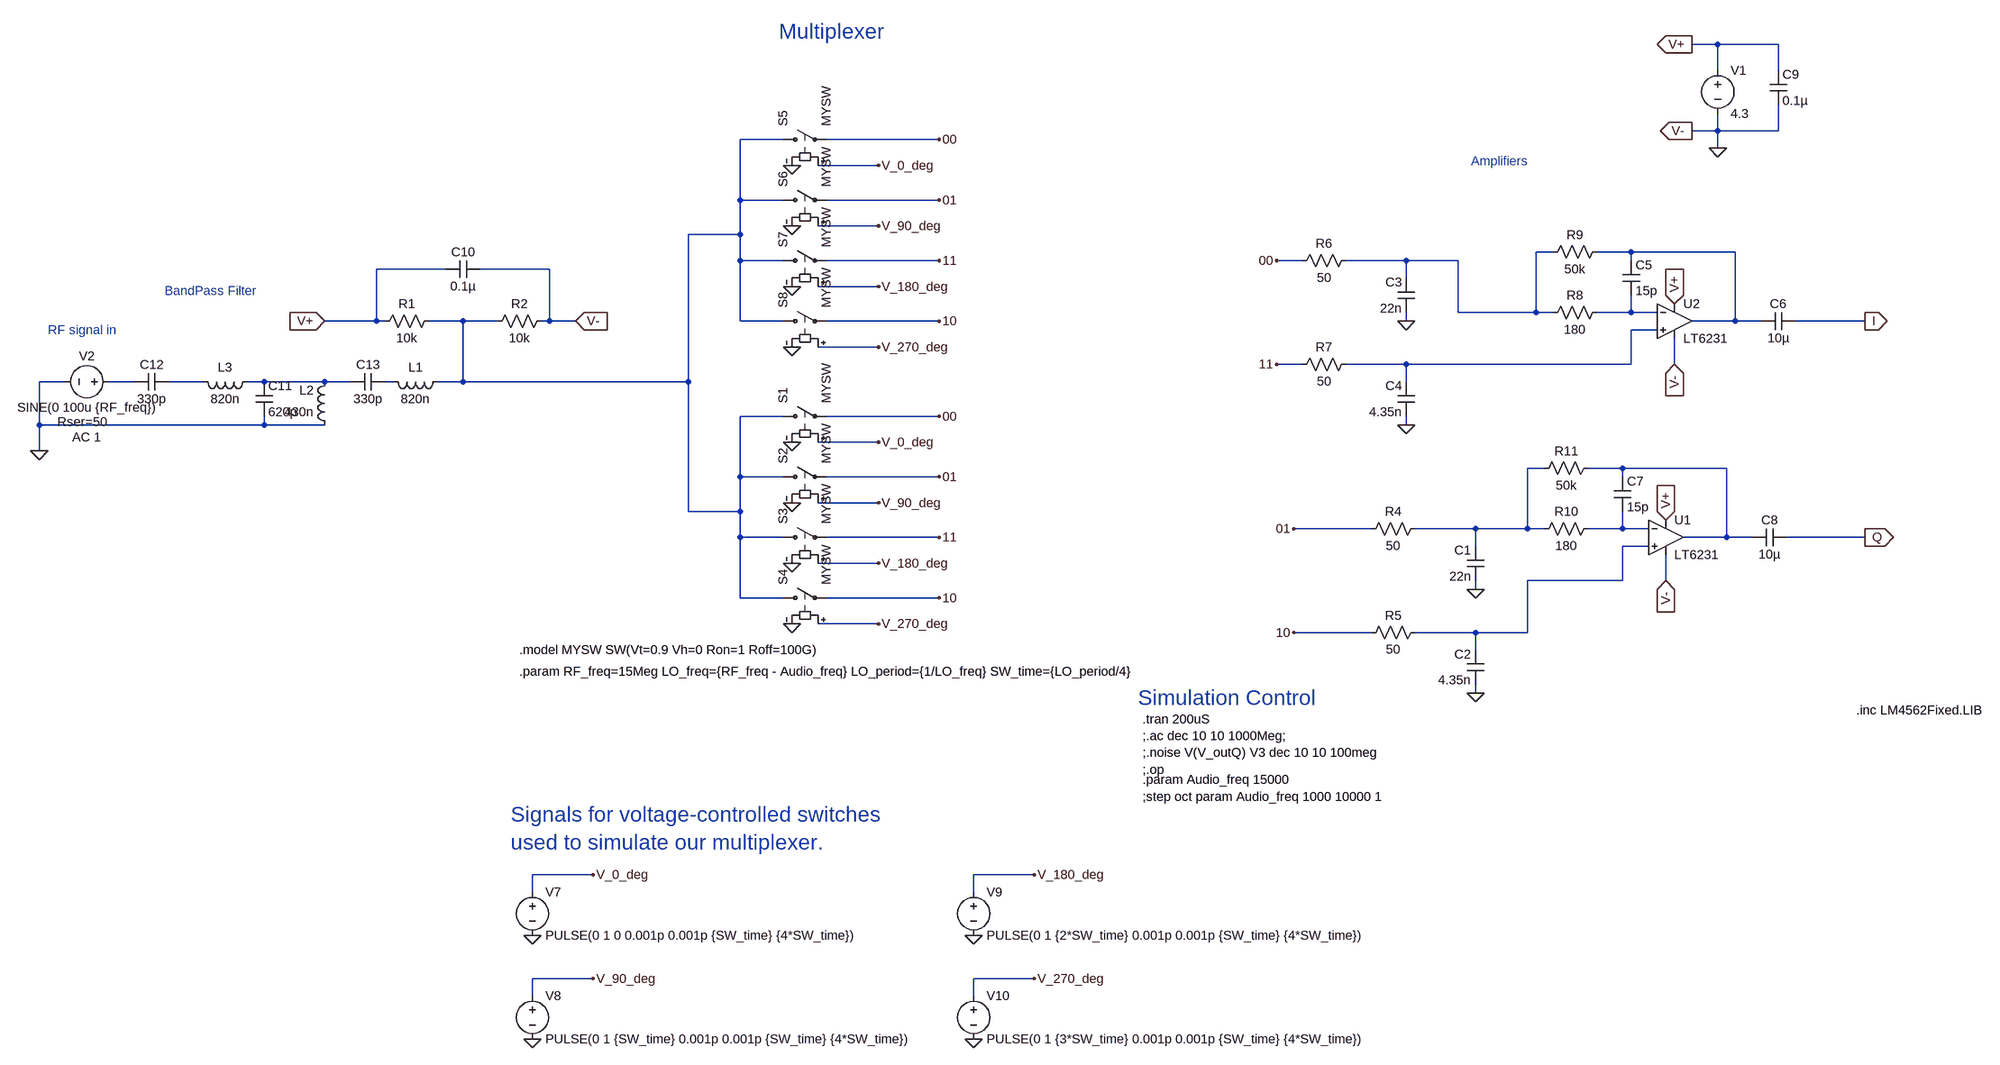
[diagram p0: schematic SImulation tests.asc]
SImulation tests.asc, the LTspice schematic file:
Version 4
SHEET 1 1280 680
WIRE -336 -1360 -384 -1360
WIRE -224 -1360 -336 -1360
WIRE -336 -1312 -336 -1360
WIRE -224 -1312 -224 -1360
WIRE -336 -1200 -336 -1232
WIRE -336 -1200 -384 -1200
WIRE -224 -1200 -224 -1248
WIRE -224 -1200 -336 -1200
WIRE -2064 -1184 -2144 -1184
WIRE -1776 -1184 -1984 -1184
WIRE -336 -1168 -336 -1200
WIRE -1888 -1136 -2000 -1136
WIRE -2144 -1072 -2144 -1184
WIRE -2064 -1072 -2144 -1072
WIRE -1776 -1072 -1984 -1072
WIRE -1888 -1024 -2000 -1024
WIRE -2144 -1008 -2144 -1072
WIRE -2144 -1008 -2240 -1008
WIRE -640 -976 -672 -976
WIRE -496 -976 -560 -976
WIRE -304 -976 -496 -976
WIRE -2144 -960 -2144 -1008
WIRE -2064 -960 -2144 -960
WIRE -1776 -960 -1984 -960
WIRE -1104 -960 -1152 -960
WIRE -912 -960 -1024 -960
WIRE -816 -960 -912 -960
WIRE -496 -960 -496 -976
WIRE -2688 -944 -2816 -944
WIRE -2496 -944 -2624 -944
WIRE -912 -928 -912 -960
WIRE -1888 -912 -2000 -912
WIRE -816 -864 -816 -960
WIRE -672 -864 -672 -976
WIRE -672 -864 -816 -864
WIRE -640 -864 -672 -864
WIRE -496 -864 -496 -896
WIRE -496 -864 -560 -864
WIRE -448 -864 -496 -864
WIRE -2816 -848 -2816 -944
WIRE -2816 -848 -2912 -848
WIRE -2800 -848 -2816 -848
WIRE -2656 -848 -2720 -848
WIRE -2592 -848 -2656 -848
WIRE -2496 -848 -2496 -944
WIRE -2496 -848 -2512 -848
WIRE -2448 -848 -2496 -848
WIRE -2144 -848 -2144 -960
WIRE -2064 -848 -2144 -848
WIRE -1776 -848 -1984 -848
WIRE -912 -848 -912 -864
WIRE -304 -848 -304 -976
WIRE -304 -848 -384 -848
WIRE -256 -848 -304 -848
WIRE -64 -848 -192 -848
WIRE -448 -832 -496 -832
WIRE -1888 -800 -2000 -800
WIRE -1104 -768 -1152 -768
WIRE -912 -768 -1024 -768
WIRE -496 -768 -496 -832
WIRE -496 -768 -912 -768
WIRE -416 -768 -416 -816
WIRE -3392 -736 -3440 -736
WIRE -3264 -736 -3312 -736
WIRE -3136 -736 -3200 -736
WIRE -3024 -736 -3056 -736
WIRE -2912 -736 -3024 -736
WIRE -2864 -736 -2912 -736
WIRE -2784 -736 -2800 -736
WIRE -2656 -736 -2656 -848
WIRE -2656 -736 -2704 -736
WIRE -2240 -736 -2240 -1008
WIRE -2240 -736 -2656 -736
WIRE -912 -736 -912 -768
WIRE -2064 -672 -2144 -672
WIRE -1776 -672 -1984 -672
WIRE -3440 -656 -3440 -736
WIRE -3024 -656 -3024 -672
WIRE -3024 -656 -3440 -656
WIRE -2912 -656 -3024 -656
WIRE -912 -656 -912 -672
WIRE -1888 -624 -2000 -624
WIRE -3440 -608 -3440 -656
WIRE -656 -576 -688 -576
WIRE -512 -576 -576 -576
WIRE -320 -576 -512 -576
WIRE -2144 -560 -2144 -672
WIRE -2064 -560 -2144 -560
WIRE -1776 -560 -1984 -560
WIRE -512 -560 -512 -576
WIRE -1888 -512 -2000 -512
WIRE -2240 -496 -2240 -736
WIRE -2144 -496 -2144 -560
WIRE -2144 -496 -2240 -496
WIRE -976 -464 -1120 -464
WIRE -784 -464 -896 -464
WIRE -688 -464 -688 -576
WIRE -688 -464 -784 -464
WIRE -656 -464 -688 -464
WIRE -512 -464 -512 -496
WIRE -512 -464 -576 -464
WIRE -464 -464 -512 -464
WIRE -2144 -448 -2144 -496
WIRE -2064 -448 -2144 -448
WIRE -1776 -448 -1984 -448
WIRE -320 -448 -320 -576
WIRE -320 -448 -400 -448
WIRE -272 -448 -320 -448
WIRE -64 -448 -208 -448
WIRE -784 -432 -784 -464
WIRE -464 -432 -512 -432
WIRE -1888 -400 -2000 -400
WIRE -512 -368 -512 -432
WIRE -512 -368 -688 -368
WIRE -432 -368 -432 -416
WIRE -784 -352 -784 -368
WIRE -2144 -336 -2144 -448
WIRE -2064 -336 -2144 -336
WIRE -1776 -336 -1984 -336
WIRE -1888 -288 -2000 -288
WIRE -976 -272 -1120 -272
WIRE -784 -272 -896 -272
WIRE -688 -272 -688 -368
WIRE -688 -272 -784 -272
WIRE -784 -240 -784 -272
WIRE -784 -160 -784 -176
WIRE -2416 176 -2528 176
WIRE -1600 176 -1712 176
WIRE -2528 208 -2528 176
WIRE -1712 208 -1712 176
WIRE -2416 368 -2528 368
WIRE -1600 368 -1712 368
WIRE -2528 400 -2528 368
WIRE -1712 400 -1712 368
FLAG -2048 -624 0
FLAG -2048 -512 0
FLAG -2048 -400 0
FLAG -2048 -288 0
FLAG -1888 -624 V_0_deg
FLAG -1888 -512 V_90_deg
FLAG -1888 -400 V_180_deg
FLAG -1888 -288 V_270_deg
FLAG -2528 288 0
FLAG -2416 176 V_0_deg
FLAG -2528 480 0
FLAG -2416 368 V_90_deg
FLAG -1712 288 0
FLAG -1600 176 V_180_deg
FLAG -1712 480 0
FLAG -1600 368 V_270_deg
FLAG -1776 -672 00
FLAG -1776 -448 11
FLAG -784 -160 0
FLAG -784 -352 0
FLAG -1776 -560 01
FLAG -1776 -336 10
FLAG -912 -656 0
FLAG -912 -848 0
FLAG -1152 -768 11
FLAG -1152 -960 00
FLAG -1120 -272 10
FLAG -1120 -464 01
FLAG -336 -1168 0
FLAG -384 -1360 V+
IOPIN -384 -1360 Out
FLAG -384 -1200 V-
IOPIN -384 -1200 Out
FLAG -416 -880 V+
IOPIN -416 -880 In
FLAG -432 -480 V+
IOPIN -432 -480 In
FLAG -416 -768 V-
IOPIN -416 -768 In
FLAG -432 -368 V-
IOPIN -432 -368 In
FLAG -64 -848 I
IOPIN -64 -848 Out
FLAG -64 -448 Q
IOPIN -64 -448 Out
FLAG -2048 -1136 0
FLAG -2048 -1024 0
FLAG -2048 -912 0
FLAG -2048 -800 0
FLAG -1888 -1136 V_0_deg
FLAG -1888 -1024 V_90_deg
FLAG -1888 -912 V_180_deg
FLAG -1888 -800 V_270_deg
FLAG -1776 -1184 00
FLAG -1776 -960 11
FLAG -1776 -1072 01
FLAG -1776 -848 10
FLAG -2912 -848 V+
IOPIN -2912 -848 In
FLAG -2448 -848 V-
IOPIN -2448 -848 In
FLAG -3440 -608 0
SYMBOL sw -2080 -672 R270
SYMATTR InstName S1
SYMATTR Value MYSW
SYMBOL sw -2080 -560 R270
SYMATTR InstName S2
SYMATTR Value MYSW
SYMBOL sw -2080 -448 R270
SYMATTR InstName S3
SYMATTR Value MYSW
SYMBOL sw -2080 -336 R270
SYMATTR InstName S4
SYMATTR Value MYSW
SYMBOL voltage -2528 192 R0
WINDOW 123 0 0 Left 0
WINDOW 39 0 0 Left 0
SYMATTR InstName V7
SYMATTR Value PULSE(0 1 0 0.001p 0.001p {SW_time} {4*SW_time})
SYMBOL voltage -2528 384 R0
WINDOW 123 0 0 Left 0
WINDOW 39 0 0 Left 0
SYMATTR InstName V8
SYMATTR Value PULSE(0 1 {SW_time} 0.001p 0.001p {SW_time} {4*SW_time})
SYMBOL voltage -1712 192 R0
WINDOW 123 0 0 Left 0
WINDOW 39 0 0 Left 0
SYMATTR InstName V9
SYMATTR Value PULSE(0 1 {2*SW_time} 0.001p 0.001p {SW_time} {4*SW_time})
SYMBOL voltage -1712 384 R0
WINDOW 123 0 0 Left 0
WINDOW 39 0 0 Left 0
SYMATTR InstName V10
SYMATTR Value PULSE(0 1 {3*SW_time} 0.001p 0.001p {SW_time} {4*SW_time})
SYMBOL cap -768 -368 R180
WINDOW 0 24 56 Left 2
WINDOW 3 24 8 Left 2
SYMATTR InstName C1
SYMATTR Value 22n
SYMBOL cap -768 -176 R180
WINDOW 0 24 56 Left 2
WINDOW 3 24 8 Left 2
SYMATTR InstName C2
SYMATTR Value 4.35n
SYMBOL res -880 -480 R90
WINDOW 0 0 56 VBottom 2
WINDOW 3 32 56 VTop 2
SYMATTR InstName R4
SYMATTR Value 50
SYMBOL res -880 -288 R90
WINDOW 0 0 56 VBottom 2
WINDOW 3 32 56 VTop 2
SYMATTR InstName R5
SYMATTR Value 50
SYMBOL cap -896 -864 R180
WINDOW 0 24 56 Left 2
WINDOW 3 24 8 Left 2
SYMATTR InstName C3
SYMATTR Value 22n
SYMBOL cap -896 -672 R180
WINDOW 0 24 56 Left 2
WINDOW 3 24 8 Left 2
SYMATTR InstName C4
SYMATTR Value 4.35n
SYMBOL res -1008 -976 R90
WINDOW 0 0 56 VBottom 2
WINDOW 3 32 56 VTop 2
SYMATTR InstName R6
SYMATTR Value 50
SYMBOL res -1008 -784 R90
WINDOW 0 0 56 VBottom 2
WINDOW 3 32 56 VTop 2
SYMATTR InstName R7
SYMATTR Value 50
SYMBOL res -544 -880 R90
WINDOW 0 0 56 VBottom 2
WINDOW 3 32 56 VTop 2
SYMATTR InstName R8
SYMATTR Value 180
SYMBOL res -544 -992 R90
WINDOW 0 0 56 VBottom 2
WINDOW 3 32 56 VTop 2
SYMATTR InstName R9
SYMATTR Value 50k
SYMBOL cap -512 -960 R0
SYMATTR InstName C5
SYMATTR Value 15p
SYMBOL cap -192 -864 R90
WINDOW 0 0 32 VBottom 2
WINDOW 3 32 32 VTop 2
SYMATTR InstName C6
SYMATTR Value 10µ
SYMBOL res -560 -480 R90
WINDOW 0 0 56 VBottom 2
WINDOW 3 32 56 VTop 2
SYMATTR InstName R10
SYMATTR Value 180
SYMBOL res -560 -592 R90
WINDOW 0 0 56 VBottom 2
WINDOW 3 32 56 VTop 2
SYMATTR InstName R11
SYMATTR Value 50k
SYMBOL cap -528 -560 R0
SYMATTR InstName C7
SYMATTR Value 15p
SYMBOL cap -208 -464 R90
WINDOW 0 0 32 VBottom 2
WINDOW 3 32 32 VTop 2
SYMATTR InstName C8
SYMATTR Value 10µ
SYMBOL voltage -336 -1328 R0
SYMATTR InstName V1
SYMATTR Value 4.3
SYMBOL cap -240 -1312 R0
SYMATTR InstName C9
SYMATTR Value 0.1µ
SYMBOL sw -2080 -1184 R270
SYMATTR InstName S5
SYMATTR Value MYSW
SYMBOL sw -2080 -1072 R270
SYMATTR InstName S6
SYMATTR Value MYSW
SYMBOL sw -2080 -960 R270
SYMATTR InstName S7
SYMATTR Value MYSW
SYMBOL sw -2080 -848 R270
SYMATTR InstName S8
SYMATTR Value MYSW
SYMBOL voltage -3296 -736 R90
WINDOW 0 -32 56 VBottom 2
WINDOW 3 32 56 VTop 2
WINDOW 123 118 56 VBottom 2
WINDOW 39 90 64 VBottom 2
SYMATTR InstName V2
SYMATTR Value SINE(0 100u {RF_freq})
SYMATTR Value2 AC 1
SYMATTR SpiceLine Rser=50
SYMBOL res -2704 -864 R90
WINDOW 0 0 56 VBottom 2
WINDOW 3 32 56 VTop 2
SYMATTR InstName R1
SYMATTR Value 10k
SYMBOL res -2496 -864 R90
WINDOW 0 0 56 VBottom 2
WINDOW 3 32 56 VTop 2
SYMATTR InstName R2
SYMATTR Value 10k
SYMBOL cap -2624 -960 R90
WINDOW 0 0 32 VBottom 2
WINDOW 3 32 32 VTop 2
SYMATTR InstName C10
SYMATTR Value 0.1µ
SYMBOL ind -2688 -752 R90
WINDOW 0 5 56 VBottom 2
WINDOW 3 32 56 VTop 2
SYMATTR InstName L1
SYMATTR Value 820n
SYMBOL cap -3040 -736 R0
SYMATTR InstName C11
SYMATTR Value 620p
SYMBOL cap -3200 -752 R90
WINDOW 0 0 32 VBottom 2
WINDOW 3 32 32 VTop 2
SYMATTR InstName C12
SYMATTR Value 330p
SYMBOL ind -2896 -640 R180
WINDOW 0 36 80 Left 2
WINDOW 3 36 40 Left 2
SYMATTR InstName L2
SYMATTR Value 430n
SYMBOL ind -3040 -752 R90
WINDOW 0 5 56 VBottom 2
WINDOW 3 32 56 VTop 2
SYMATTR InstName L3
SYMATTR Value 820n
SYMBOL cap -2800 -752 R90
WINDOW 0 0 32 VBottom 2
WINDOW 3 32 32 VTop 2
SYMATTR InstName C13
SYMATTR Value 330p
SYMBOL Opamps/LT6231 -432 -448 R0
SYMATTR InstName U1
SYMBOL Opamps/LT6231 -416 -848 R0
SYMATTR InstName U2
TEXT -80 -128 Left 2 !.inc LM4562Fixed.LIB
TEXT -2552 -240 Left 2 !.model MYSW SW(Vt=0.9 Vh=0 Ron=1 Roff=100G)
TEXT -1400 -112 Left 2 !.tran 200uS\n;.ac dec 10 10 1000Meg;\n;.noise V(V_outQ) V3 dec 10 10 100meg\n;.op
TEXT -2552 -200 Left 2 !.param RF_freq=15Meg LO_freq={RF_freq - Audio_freq} LO_period={1/LO_freq} SW_time={LO_period/4}
TEXT -2568 64 Left 4 ;Signals for voltage-controlled switches \nused to simulate our multiplexer.
TEXT -2072 -1384 Left 4 ;Multiplexer
TEXT -1408 -152 Left 4 ;Simulation Control
TEXT -1400 32 Left 2 !;step oct param Audio_freq 1000 10000 1
TEXT -1400 0 Left 2 !.param Audio_freq 15000
TEXT -3424 -832 Left 2 ;RF signal in
TEXT -3208 -904 Left 2 ;BandPass Filter
TEXT -792 -1144 Left 2 ;Amplifiers

The netlist it stands for:
* SImulation tests.asc
S1 N001 00 V_0_deg 0 MYSW
S2 N001 01 V_90_deg 0 MYSW
S3 N001 11 V_180_deg 0 MYSW
S4 N001 10 V_270_deg 0 MYSW
V7 V_0_deg 0 PULSE(0 1 0 0.001p 0.001p {SW_time} {4*SW_time})
V8 V_90_deg 0 PULSE(0 1 {SW_time} 0.001p 0.001p {SW_time} {4*SW_time})
V9 V_180_deg 0 PULSE(0 1 {2*SW_time} 0.001p 0.001p {SW_time} {4*SW_time})
V10 V_270_deg 0 PULSE(0 1 {3*SW_time} 0.001p 0.001p {SW_time} {4*SW_time})
C1 0 N010 22n
C2 0 N013 4.35n
R4 N010 01 50
R5 N013 10 50
C3 0 N002 22n
C4 0 N005 4.35n
R6 N002 00 50
R7 N005 11 50
R8 N004 N002 180
R9 N003 N002 50k
C5 N003 N004 15p
C6 I N003 10µ
R10 N012 N010 180
R11 N011 N010 50k
C7 N011 N012 15p
C8 Q N011 10µ
V1 V+ 0 4.3
C9 V+ 0 0.1µ
S5 N001 00 V_0_deg 0 MYSW
S6 N001 01 V_90_deg 0 MYSW
S7 N001 11 V_180_deg 0 MYSW
S8 N001 10 V_270_deg 0 MYSW
V2 N006 0 SINE(0 100u {RF_freq}) AC 1 Rser=50
R1 N001 V+ 10k
R2 0 N001 10k
C10 0 V+ 0.1µ
L1 N001 N009 820n
C11 N008 0 620p
C12 N007 N006 330p
L2 0 N008 430n
L3 N008 N007 820n
C13 N009 N008 330p
XU1 N013 N012 N011 V+ 0 LT6231  ; pins In+ In- OUT V+ V-
XU2 N005 N004 N003 V+ 0 LT6231  ; pins In+ In- OUT V+ V-
.inc LM4562Fixed.LIB
.model MYSW SW(Vt=0.9 Vh=0 Ron=1 Roff=100G)
.tran 200uS
;.ac dec 10 10 1000Meg;
;.noise V(V_outQ) V3 dec 10 10 100meg
;.op
.param RF_freq=15Meg LO_freq={RF_freq - Audio_freq} LO_period={1/LO_freq} SW_time={LO_period/4}
* Signals for voltage-controlled switches
* used to simulate our multiplexer.
* Multiplexer
* Simulation Control
;step oct param Audio_freq 1000 10000 1
.param Audio_freq 15000
* RF signal in
* BandPass Filter
* Amplifiers
.lib LTC2.lib
.backanno
.end